# EAGLE design Sifteo Thundercracker Buddy NB Breakout (EAGLE 5.11)
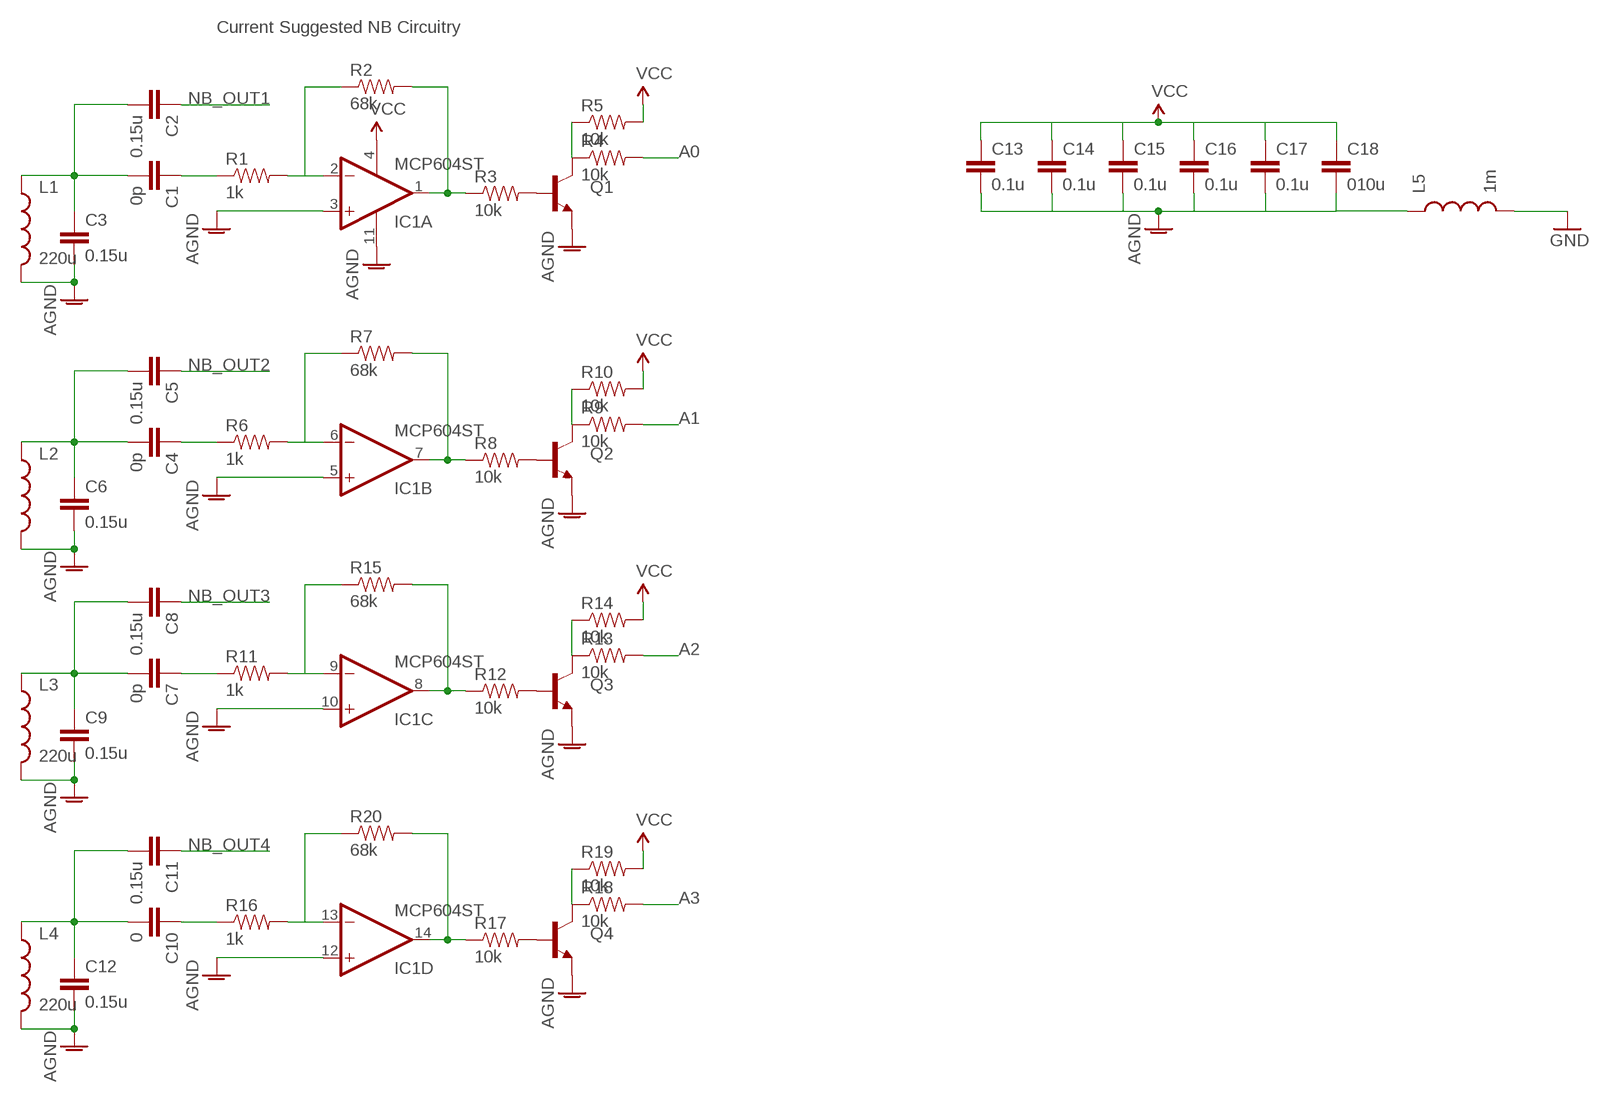
[diagram p0: schematic, sheet 1]

## Parts
C1  0p  CAP0402-CAP  [0402-CAP]
C2  0.15u  CAP0402-CAP  [0402-CAP]
C3  0.15u  CAP0402-CAP  [0402-CAP]
C4  0p  CAP0402-CAP  [0402-CAP]
C5  0.15u  CAP0402-CAP  [0402-CAP]
C6  0.15u  CAP0402-CAP  [0402-CAP]
C7  0p  CAP0402-CAP  [0402-CAP]
C8  0.15u  CAP0402-CAP  [0402-CAP]
C9  0.15u  CAP0402-CAP  [0402-CAP]
C10  0  CAP0402-CAP  [0402-CAP]
C11  0.15u  CAP0402-CAP  [0402-CAP]
C12  0.15u  CAP0402-CAP  [0402-CAP]
C13  0.1u  CAP0402-CAP  [0402-CAP]
C14  0.1u  CAP0402-CAP  [0402-CAP]
C15  0.1u  CAP0402-CAP  [0402-CAP]
C16  0.1u  CAP0402-CAP  [0402-CAP]
C17  0.1u  CAP0402-CAP  [0402-CAP]
C18  010u  CAP0402-CAP  [0402-CAP]
IC1  MCP604ST  [TSSOP14]
L1  220u  INDUCTOR0805  [0805]
L2  INDUCTOR0805  [0805]
L3  220u  INDUCTOR0805  [0805]
L4  220u  INDUCTOR0805  [0805]
L5  1m  INDUCTOR0805  [0805]
Q1  TRANSISTOR_NPNSOT23-3  [SOT23-3]
Q2  TRANSISTOR_NPNSOT23-3  [SOT23-3]
Q3  TRANSISTOR_NPNSOT23-3  [SOT23-3]
Q4  TRANSISTOR_NPNSOT23-3  [SOT23-3]
R1  1k  RESISTOR0402-RES  [0402-RES]
R2  68k  RESISTOR0402-RES  [0402-RES]
R3  10k  RESISTOR0402-RES  [0402-RES]
R4  10k  RESISTOR0402-RES  [0402-RES]
R5  10k  RESISTOR0402-RES  [0402-RES]
R6  1k  RESISTOR0402-RES  [0402-RES]
R7  68k  RESISTOR0402-RES  [0402-RES]
R8  10k  RESISTOR0402-RES  [0402-RES]
R9  10k  RESISTOR0402-RES  [0402-RES]
R10  10k  RESISTOR0402-RES  [0402-RES]
R11  1k  RESISTOR0402-RES  [0402-RES]
R12  10k  RESISTOR0402-RES  [0402-RES]
R13  10k  RESISTOR0402-RES  [0402-RES]
R14  10k  RESISTOR0402-RES  [0402-RES]
R15  68k  RESISTOR0402-RES  [0402-RES]
R16  1k  RESISTOR0402-RES  [0402-RES]
R17  10k  RESISTOR0402-RES  [0402-RES]
R18  10k  RESISTOR0402-RES  [0402-RES]
R19  10k  RESISTOR0402-RES  [0402-RES]
R20  68k  RESISTOR0402-RES  [0402-RES]

## Nets
A0: R4.2
A1: R9.2
A2: R13.2
A3: R18.2
AGND: C3.2 C6.2 C9.2 C12.2 C13.2 C14.2 C15.2 C16.2 C17.2 C18.2 IC1.3(A:+IN) IC1.5(B:+IN) IC1.10(C:+IN) IC1.11(P:V-) IC1.12(D:+IN) L1.2 L2.2 L3.2 L4.2 L5.1 Q1.2(E) Q2.2(E) Q3.2(E) Q4.2(E)
GND: L5.2
N$1: IC1.2(A:-IN) R1.2 R2.1
N$2: IC1.1(A:OUT) R2.2 R3.1
N$3: C1.1 R1.1
N$4: C1.2 C2.2 C3.1 L1.1
N$5: Q1.1(B) R3.2
N$6: Q1.3(C) R4.1 R5.1
N$7: IC1.6(B:-IN) R6.2 R7.1
N$8: IC1.7(B:OUT) R7.2 R8.1
N$9: C4.1 R6.1
N$10: C4.2 C5.2 C6.1 L2.1
N$11: Q2.1(B) R8.2
N$12: Q2.3(C) R9.1 R10.1
N$13: IC1.9(C:-IN) R11.2
N$14: IC1.8(C:OUT) R12.1
N$15: C7.1 R11.1
N$16: C7.2 C8.2 C9.1 L3.1
N$17: Q3.1(B) R12.2
N$18: Q3.3(C) R13.1 R14.1
N$19: R15.1
N$20: R15.2
N$21: IC1.13(D:-IN) R16.2
N$22: IC1.14(D:OUT) R17.1
N$23: C10.1 R16.1
N$24: C10.2 C11.2 C12.1 L4.1
N$25: Q4.1(B) R17.2
N$26: Q4.3(C) R18.1 R19.1
N$27: R20.1
N$28: R20.2
NB_OUT1: C2.1
NB_OUT2: C5.1
NB_OUT3: C8.1
NB_OUT4: C11.1
VCC: C13.1 C14.1 C15.1 C16.1 C17.1 C18.1 IC1.4(P:V+) R5.2 R10.2 R14.2 R19.2

## Notes on the sheet
- Current Suggested NB Circuitry

## Library data of the parts
C1-C18 = SparkFun:CAP: Capacitor Standard 0603 ceramic capacitor, and 0.1" leaded capacitor.
IC1 = linear:MCP604: Quad Op Amp 2.7V to 6.0V Single Supply CMOS Source: http://ww1.microchip.com/downloads/en/DeviceDoc/21314g.pdf
L1-L5 = SparkFun:INDUCTOR: Inductors Basic Inductor/Choke - 0603 and 1206. Footprints are not proven and vary greatly between part numbers.
Q1-Q4 = SparkFun:TRANSISTOR_NPN: Transistor NPN BJT configuration in SOT23 package. MMBT2222 is the common NPN we use. Double check BCE configuration again layout.
R1-R20 = SparkFun:RESISTOR: Resistor Basic schematic elements and footprints for 0603, 1206, and PTH resistors.

## Board
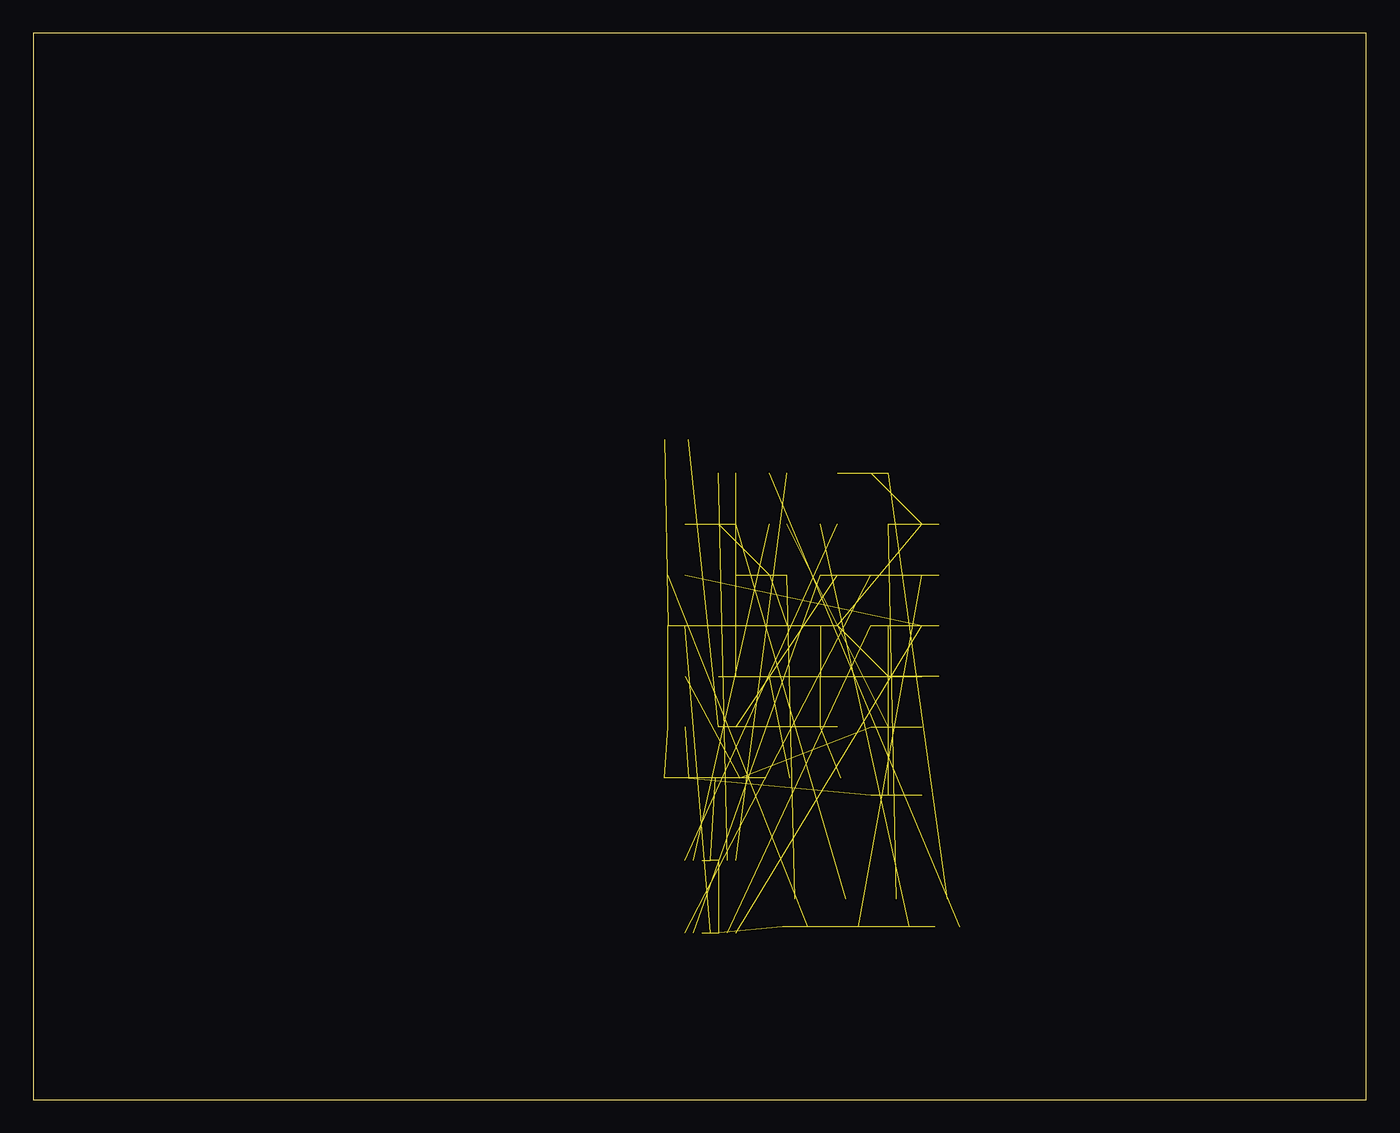
[diagram p1: board, top side]
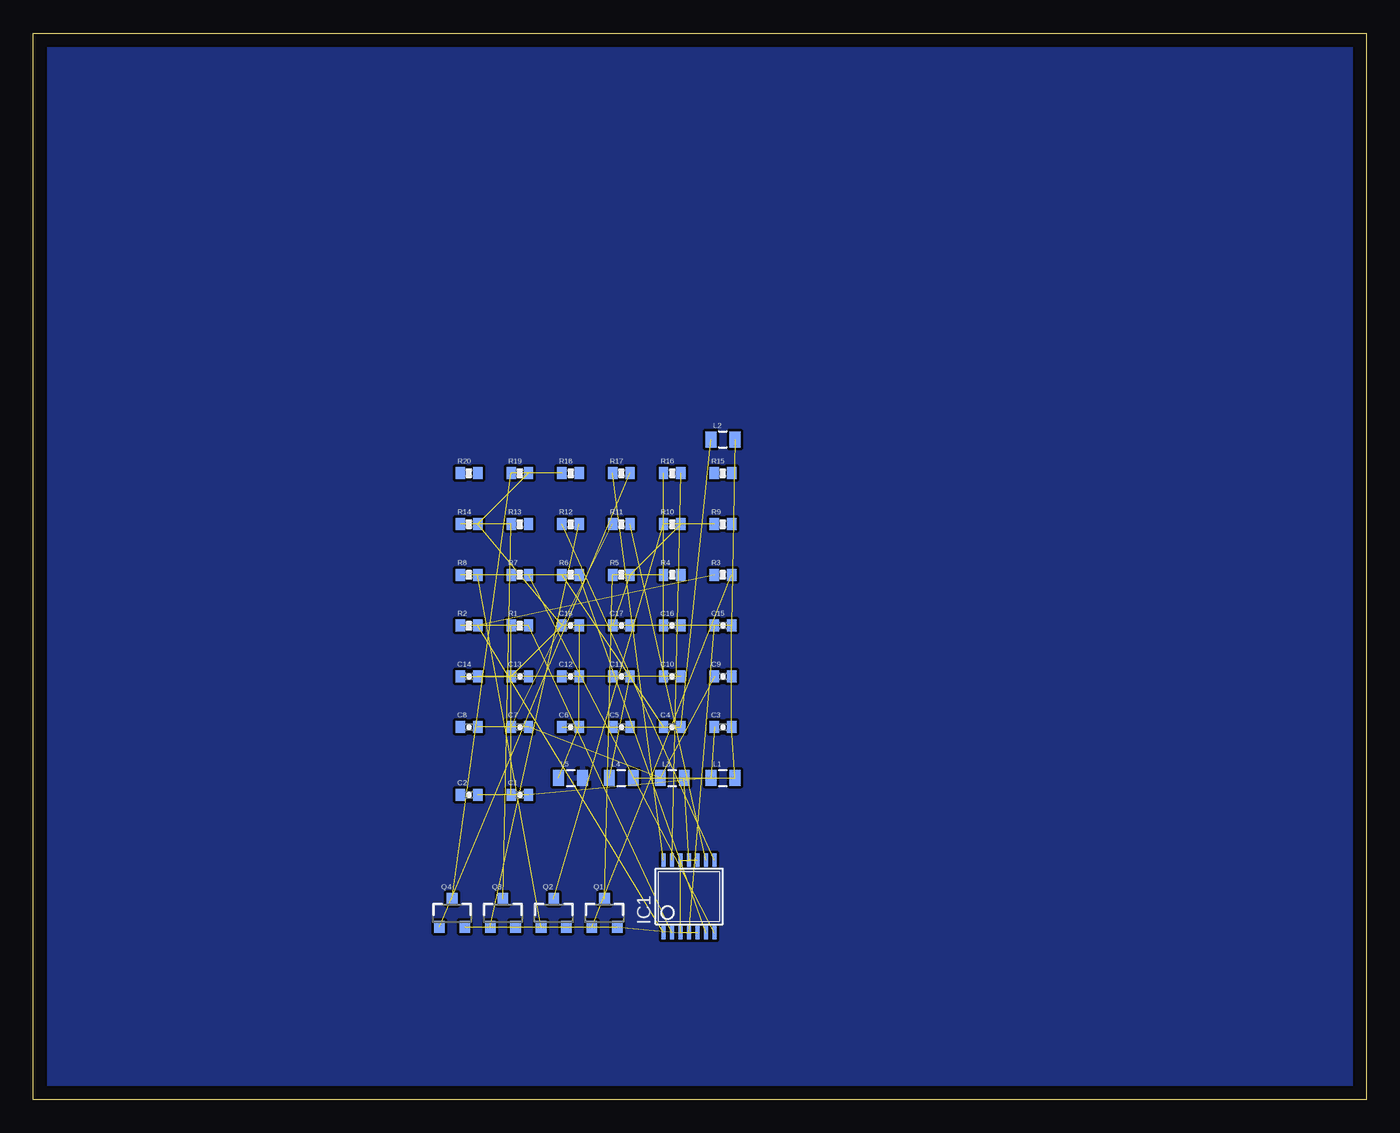
[diagram p2: board, bottom side, seen from below]

Size 100 x 80 mm. Coordinates in mm from the lower left corner, seen from the top.
Outline: 0,0 100,0 100,80 0,80 0,0
Copper layers (1*16): Top 0.035mm / dielectric 1.5mm / Bottom 0.035mm
Design rules "default": minimum track width 10mil, minimum drill 24mil, track to track 8mil, track to pad 8mil, pad to pad 8mil, via to via 8mil, smd to smd 8mil, copper to edge 40mil, drill to drill 8mil, minimum pad ring 10mil, minimum via ring 8mil, stop-mask expansion 4mil, vias tented up to drill 0mil, thermal gap 10mil

### Footprints (pad centres in the part's own frame; a part is rotated, then mirrored left to right if it is on the bottom)
0402-CAP = smd 0.7 x 0.9: 1 -0.65,0; 2 0.65,0
TSSOP14 = smd 0.305 x 0.991: 1 -1.905,-2.718; 2 -1.27,-2.718; 3 -0.635,-2.718; 4 0,-2.718; 5 0.635,-2.718; 6 1.27,-2.718; 7 1.905,-2.718; 8 1.905,2.718; 9 1.27,2.718; 10 0.635,2.718; 11 0,2.718; 12 -0.635,2.718; 13 -1.27,2.718; 14 -1.905,2.718
0805 = smd 0.8 x 1.2: 1 -0.9,0; 2 0.9,0
SOT23-3 = smd 0.8 x 0.9: 1 -0.95,-1; 2 0.95,-1; 3 0,1.1
0402-RES = smd 0.7 x 0.9: 1 -0.65,0; 2 0.65,0

### Placement (x,y rotation side)
C1  63.5,22.86 0 bottom
C2  67.31,22.86 0 bottom
C3  48.26,27.94 0 bottom
C4  52.07,27.94 0 bottom
C5  55.88,27.94 0 bottom
C6  59.69,27.94 0 bottom
C7  63.5,27.94 0 bottom
C8  67.31,27.94 0 bottom
C9  48.26,31.75 0 bottom
C10  52.07,31.75 0 bottom
C11  55.88,31.75 0 bottom
C12  59.69,31.75 0 bottom
C13  63.5,31.75 0 bottom
C14  67.31,31.75 0 bottom
C15  48.26,35.56 0 bottom
C16  52.07,35.56 0 bottom
C17  55.88,35.56 0 bottom
C18  59.69,35.56 0 bottom
IC1  50.8,15.24 0 bottom
L1  48.26,24.13 0 bottom
L2  48.26,49.53 0 bottom
L3  52.07,24.13 0 bottom
L4  55.88,24.13 0 bottom
L5  59.69,24.13 0 bottom
Q1  57.15,13.97 0 bottom
Q2  60.96,13.97 0 bottom
Q3  64.77,13.97 0 bottom
Q4  68.58,13.97 0 bottom
R1  63.5,35.56 0 bottom
R2  67.31,35.56 0 bottom
R3  48.26,39.37 0 bottom
R4  52.07,39.37 0 bottom
R5  55.88,39.37 0 bottom
R6  59.69,39.37 0 bottom
R7  63.5,39.37 0 bottom
R8  67.31,39.37 0 bottom
R9  48.26,43.18 0 bottom
R10  52.07,43.18 0 bottom
R11  55.88,43.18 0 bottom
R12  59.69,43.18 0 bottom
R13  63.5,43.18 0 bottom
R14  67.31,43.18 0 bottom
R15  48.26,46.99 0 bottom
R16  52.07,46.99 0 bottom
R17  55.88,46.99 0 bottom
R18  59.69,46.99 0 bottom
R19  63.5,46.99 0 bottom
R20  67.31,46.99 0 bottom

### Tracks (layer width: path | path; a pad name or v marks a point on that pad's centre or on a via)
AGND  (23 unrouted)
GND
  pour Bottom: 0,0 0,80.01 99.06,80.01 99.06,0
N$1  (2 unrouted)
N$2  (2 unrouted)
N$3  (1 unrouted)
N$4  (3 unrouted)
N$5  (1 unrouted)
N$6  (2 unrouted)
N$7  (2 unrouted)
N$8  (2 unrouted)
N$9  (1 unrouted)
N$10  (3 unrouted)
N$11  (1 unrouted)
N$12  (2 unrouted)
N$13  (1 unrouted)
N$14  (1 unrouted)
N$15  (1 unrouted)
N$16  (3 unrouted)
N$17  (1 unrouted)
N$18  (2 unrouted)
N$21  (1 unrouted)
N$22  (1 unrouted)
N$23  (1 unrouted)
N$24  (3 unrouted)
N$25  (1 unrouted)
N$26  (2 unrouted)
VCC  (10 unrouted)